# Altium schematic sheet 03 存储器扩展与BOOT.SchDoc
size A4
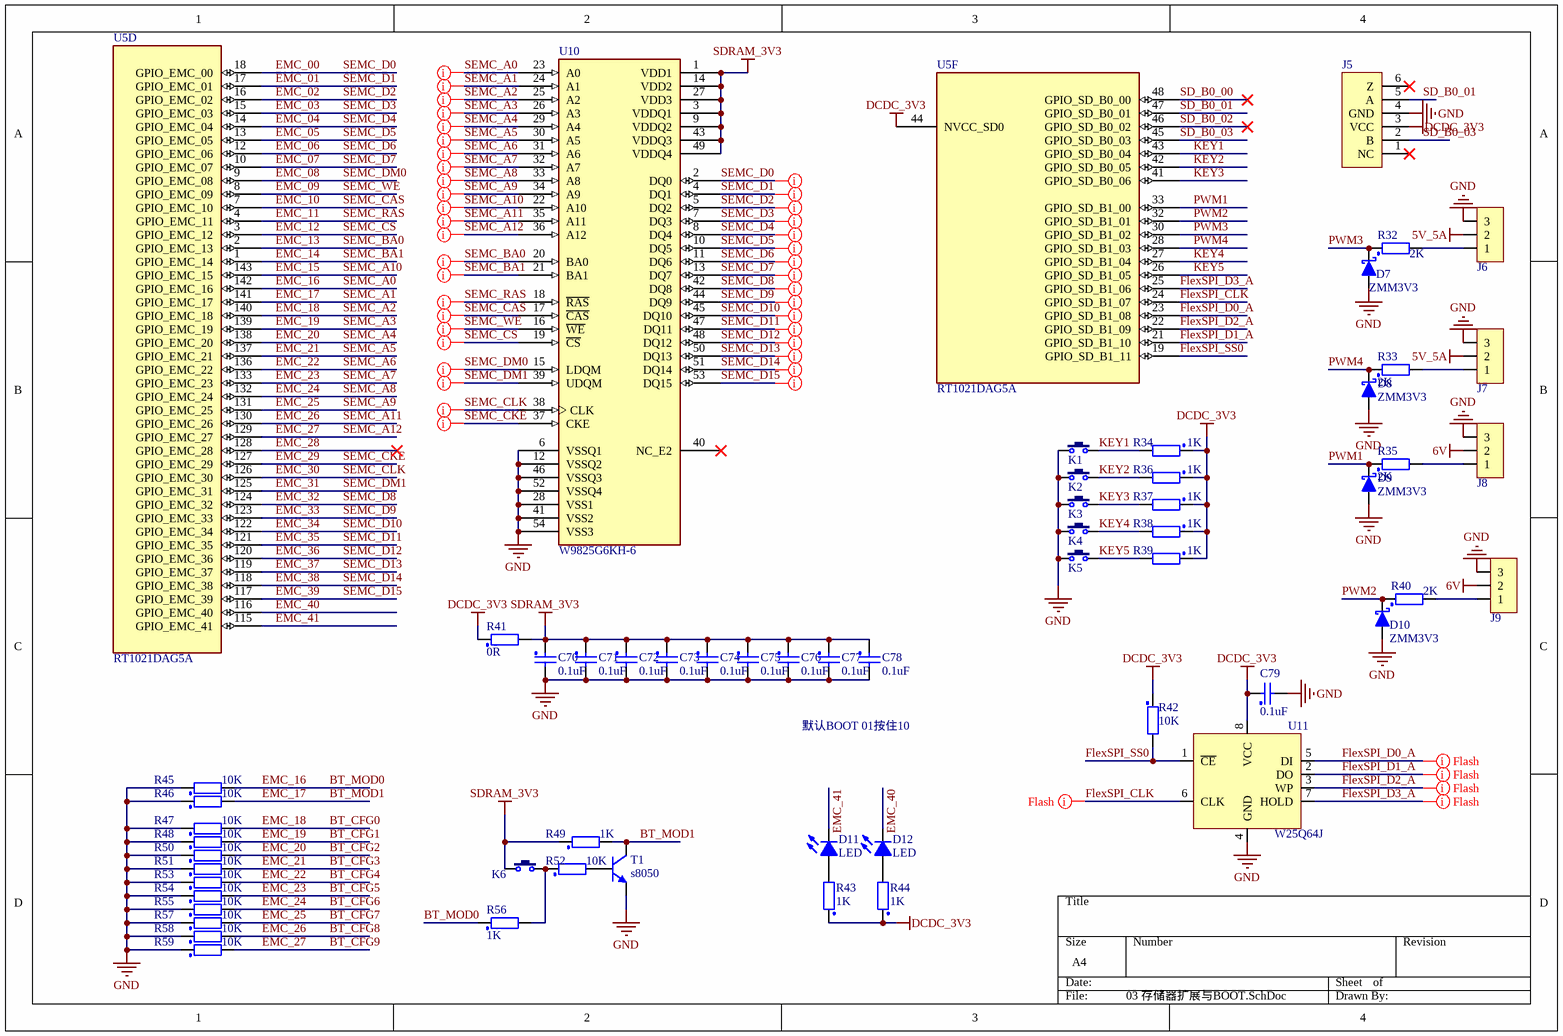
[diagram p0: 03 存储器扩展与BOOT.SchDoc]

## Parts
C70  0.1uF  [cap0603]
C71  0.1uF  [cap0603]
C72  0.1uF  [cap0603]
C73  0.1uF  [cap0603]
C74  0.1uF  [cap0603]
C75  0.1uF  [cap0603]
C76  0.1uF  [cap0603]
C77  0.1uF  [cap0603]
C78  0.1uF  [cap0603]
C79  0.1uF  [cap0603]
D7  ZMM3V3  [LL34]
D8  ZMM3V3  [LL34]
D9  ZMM3V3  [LL34]
D10  ZMM3V3  [LL34]
D11  LED  [LED]
D12  LED  [LED]
J5  2x6  [LQ256Encoder]  (value not drawn)
J6  1X3  [HDR-1X3]  (value not drawn)
J7  1X3  [HDR-1X3]  (value not drawn)
J8  1X3  [HDR-1X3]  (value not drawn)
J9  1X3  [HDR-1X3]  (value not drawn)
K1  KEY  [key]  (value not drawn)
K2  KEY  [key]  (value not drawn)
K3  KEY  [key]  (value not drawn)
K4  KEY  [key]  (value not drawn)
K5  KEY  [key]  (value not drawn)
K6  KEY  [key]  (value not drawn)
R32  2K  [res0603]
R33  2K  [res0603]
R34  1K  [res0603]
R35  2K  [res0603]
R36  1K  [res0603]
R37  1K  [res0603]
R38  1K  [res0603]
R39  1K  [res0603]
R40  2K  [res0603]
R41  0R  [res0603]
R42  10K  [res0603]
R43  1K  [res0603]
R44  1K  [res0603]
R45  10K  [res0603]
R46  10K  [res0603]
R47  10K  [res0603]
R48  10K  [res0603]
R49  1K  [res0603]
R50  10K  [res0603]
R51  10K  [res0603]
R52  10K  [res0603]
R53  10K  [res0603]
R54  10K  [res0603]
R55  10K  [res0603]
R56  1K  [res0603]
R57  10K  [res0603]
R58  10K  [res0603]
R59  10K  [res0603]
T1  s8050  [SOT-23-3]
U5  RT1021DAG5A  [LQFP144]  (parts D,F of 6)
U10  W9825G6KH-6  [TSOP(II)-54]
U11  W25Q64J  [SOIC8-208mil]

## Nets
5V_5A: J6.2 J7.2
6V: J8.2 J9.2
DCDC_3V3: C79.1 J5.3(VCC) R34.1 R36.1 R37.1 R38.1 R39.1 R41.1 R42.1 R43.1 R44.1 U5.44(NVCC_SD0) U11.8(VCC)
GND: C70.2 C71.2 C72.2 C73.2 C74.2 C75.2 C76.2 C77.2 C78.2 C79.2 D7.1(A) D8.1(A) D9.1(A) D10.1(A) J5.4(GND) J6.3 J7.3 J8.3 J9.3 K1.1 K2.1 K3.1 K4.1 K5.1 R45.1 R46.1 R47.1 R48.1 R50.1 R51.1 R53.1 R54.1 R55.1 R57.1 R58.1 R59.1 T1.2(E) U10.6(VSSQ1) U10.12(VSSQ2) U10.28(VSS1) U10.41(VSS2) U10.46(VSSQ3) U10.52(VSSQ4) U10.54(VSS3) U11.4(GND)
SDRAM_3V3: C70.1 C71.1 C72.1 C73.1 C74.1 C75.1 C76.1 C77.1 C78.1 K6.1 R41.2 R49.1 U10.1(VDD1) U10.3(VDDQ1) U10.9(VDDQ2) U10.14(VDD2) U10.27(VDD3) U10.43(VDDQ3) U10.49(VDDQ4)
BT_CFG0: R47.2 U5.140(GPIO_EMC_18) U10.25(A2)  [also labelled EMC_18, SEMC_A2]
BT_CFG1: R48.2 U5.139(GPIO_EMC_19) U10.26(A3)  [also labelled EMC_19, SEMC_A3]
BT_CFG2: R50.2 U5.138(GPIO_EMC_20) U10.29(A4)  [also labelled EMC_20, SEMC_A4]
BT_CFG3: R51.2 U5.137(GPIO_EMC_21) U10.30(A5)  [also labelled EMC_21, SEMC_A5]
BT_CFG4: R53.2 U5.136(GPIO_EMC_22) U10.31(A6)  [also labelled EMC_22, SEMC_A6]
BT_CFG5: R54.2 U5.133(GPIO_EMC_23) U10.32(A7)  [also labelled EMC_23, SEMC_A7]
BT_CFG6: R55.2 U5.132(GPIO_EMC_24) U10.33(A8)  [also labelled EMC_24, SEMC_A8]
BT_CFG7: R57.2 U5.131(GPIO_EMC_25) U10.34(A9)  [also labelled EMC_25, SEMC_A9]
BT_CFG8: R58.2 U5.130(GPIO_EMC_26) U10.35(A11)  [also labelled EMC_26, SEMC_A11]
BT_CFG9: R59.2 U5.129(GPIO_EMC_27) U10.36(A12)  [also labelled EMC_27, SEMC_A12]
BT_MOD0: R45.2 R56.1 U5.142(GPIO_EMC_16) U10.23(A0)  [also labelled EMC_16, SEMC_A0]
BT_MOD1: R46.2 R49.2 T1.3(C) U5.141(GPIO_EMC_17) U10.24(A1)  [also labelled EMC_17, SEMC_A1]
EMC_00: U5.18(GPIO_EMC_00) U10.2(DQ0)  [also labelled SEMC_D0]
EMC_01: U5.17(GPIO_EMC_01) U10.4(DQ1)  [also labelled SEMC_D1]
EMC_02: U5.16(GPIO_EMC_02) U10.5(DQ2)  [also labelled SEMC_D2]
EMC_03: U5.15(GPIO_EMC_03) U10.7(DQ3)  [also labelled SEMC_D3]
EMC_04: U5.14(GPIO_EMC_04) U10.8(DQ4)  [also labelled SEMC_D4]
EMC_05: U5.13(GPIO_EMC_05) U10.10(DQ5)  [also labelled SEMC_D5]
EMC_06: U5.12(GPIO_EMC_06) U10.11(DQ6)  [also labelled SEMC_D6]
EMC_07: U5.10(GPIO_EMC_07) U10.13(DQ7)  [also labelled SEMC_D7]
EMC_08: U5.9(GPIO_EMC_08) U10.15(LDQM)  [also labelled SEMC_DM0]
EMC_09: U5.8(GPIO_EMC_09) U10.16(~{WE})  [also labelled SEMC_WE]
EMC_10: U5.7(GPIO_EMC_10) U10.17(~{CAS})  [also labelled SEMC_CAS]
EMC_11: U5.4(GPIO_EMC_11) U10.18(~{RAS})  [also labelled SEMC_RAS]
EMC_12: U5.3(GPIO_EMC_12) U10.19(~{CS})  [also labelled SEMC_CS]
EMC_13: U5.2(GPIO_EMC_13) U10.20(BA0)  [also labelled SEMC_BA0]
EMC_14: U5.1(GPIO_EMC_14) U10.21(BA1)  [also labelled SEMC_BA1]
EMC_15: U5.143(GPIO_EMC_15) U10.22(A10)  [also labelled SEMC_A10]
EMC_28: U5.128(GPIO_EMC_28)
EMC_29: U5.127(GPIO_EMC_29) U10.37(CKE)  [also labelled SEMC_CKE]
EMC_30: U5.126(GPIO_EMC_30) U10.38(CLK)  [also labelled SEMC_CLK]
EMC_31: U5.125(GPIO_EMC_31) U10.39(UDQM)  [also labelled SEMC_DM1]
EMC_32: U5.124(GPIO_EMC_32) U10.42(DQ8)  [also labelled SEMC_D8]
EMC_33: U5.123(GPIO_EMC_33) U10.44(DQ9)  [also labelled SEMC_D9]
EMC_34: U5.122(GPIO_EMC_34) U10.45(DQ10)  [also labelled SEMC_D10]
EMC_35: U5.121(GPIO_EMC_35) U10.47(DQ11)  [also labelled SEMC_D11]
EMC_36: U5.120(GPIO_EMC_36) U10.48(DQ12)  [also labelled SEMC_D12]
EMC_37: U5.119(GPIO_EMC_37) U10.50(DQ13)  [also labelled SEMC_D13]
EMC_38: U5.118(GPIO_EMC_38) U10.51(DQ14)  [also labelled SEMC_D14]
EMC_39: U5.117(GPIO_EMC_39) U10.53(DQ15)  [also labelled SEMC_D15]
EMC_40: D12.2(K) U5.116(GPIO_EMC_40)
EMC_41: D11.2(K) U5.115(GPIO_EMC_41)
FlexSPI_CLK: U5.24(GPIO_SD_B1_07) U11.6(CLK)
FlexSPI_D0_A: U5.23(GPIO_SD_B1_08) U11.5(DI)
FlexSPI_D1_A: U5.21(GPIO_SD_B1_10) U11.2(DO)
FlexSPI_D2_A: U5.22(GPIO_SD_B1_09) U11.3(WP)
FlexSPI_D3_A: U5.25(GPIO_SD_B1_06) U11.7(HOLD)
FlexSPI_SS0: R42.2 U5.19(GPIO_SD_B1_11) U11.1(~{CE})
KEY1: K1.2 R34.2 U5.43(GPIO_SD_B0_04)
KEY2: K2.2 R36.2 U5.42(GPIO_SD_B0_05)
KEY3: K3.2 R37.2 U5.41(GPIO_SD_B0_06)
KEY4: K4.2 R38.2 U5.27(GPIO_SD_B1_04)
KEY5: K5.2 R39.2 U5.26(GPIO_SD_B1_05)
PWM1: D9.2(K) R35.1 U5.33(GPIO_SD_B1_00)
PWM2: D10.2(K) R40.1 U5.32(GPIO_SD_B1_01)
PWM3: D7.2(K) R32.1 U5.30(GPIO_SD_B1_02)
PWM4: D8.2(K) R33.1 U5.28(GPIO_SD_B1_03)
SD_B0_00: U5.48(GPIO_SD_B0_00)
SD_B0_01: J5.5(A) U5.47(GPIO_SD_B0_01)
SD_B0_02: U5.46(GPIO_SD_B0_02)
SD_B0_03: J5.2(B) U5.45(GPIO_SD_B0_03)
NetD11_1: D11.1(A) R43.2
NetD12_1: D12.1(A) R44.2
NetJ6_1: J6.1 R32.2
NetJ7_1: J7.1 R33.2
NetJ8_1: J8.1 R35.2
NetJ9_1: J9.1 R40.2
NetK6_2: K6.2 R52.1 R56.2
NetR52_2: R52.2 T1.1(B)

Not connected (* = marked no-connect by the designer): J5 1(NC)* 6(Z)*; U10 40(NC_E2)*

## Layout directives
net class FLASH: FlexSPI_CLK, FlexSPI_D0_A, FlexSPI_D1_A, FlexSPI_D2_A, FlexSPI_D3_A
net class SDRAM_A: BT_CFG0, BT_CFG1, BT_CFG2, BT_CFG3, BT_CFG4, BT_CFG5, BT_CFG6, BT_CFG7, BT_CFG8, BT_CFG9, BT_MOD0, BT_MOD1, EMC_08, EMC_09, EMC_10, EMC_11, EMC_12, EMC_13, EMC_14, EMC_15, EMC_29, EMC_30, EMC_31
net class SDRAM_D: EMC_00, EMC_01, EMC_02, EMC_03, EMC_04, EMC_05, EMC_06, EMC_07, EMC_32, EMC_33, EMC_34, EMC_35, EMC_36, EMC_37, EMC_38, EMC_39

## Notes on the sheet
- 默认BOOT 01按住10

## Library data of the parts
C70-C79 = Cap: 贴片电容; Published: 8-Jun-2000; LatestRevisionDate: 17-Jul-2002; LatestRevisionNote: Re-released for DXP Platform.; PackageReference: RAD-0.3; Publisher: Altium Limited; Value: 0.1uF
D7-D10 = D Schottky: 稳压二极管; Published: 8-Jun-2000; LatestRevisionDate: 17-Jul-2002; LatestRevisionNote: Re-released for DXP Platform.; PackageReference: SMB; Publisher: Altium Limited; Code_JEDEC: DO-214-AA
D11 D12 = LED: 贴片LED; Published: 8-Jun-2000; LatestRevisionDate: 17-Jul-2002; LatestRevisionNote: Re-released for DXP Platform.; PackageDocument: Feb-2002; PackageReference: 3.2X1.6X1.1; Publisher: Altium Limited
J5 = LQ_AB256: 2.54mm公排针
J6-J9 = Header 3: 2.54mm公排针; BOM名称: 3P接插件; 版权归属: 源创客; 学习资源: www.ooocke.com
K1-K6 = KEY: 按键; BOM名称: 3x6轻触开关; 版权归属: 源创客; 学习资源: www.ooocke.com
R32-R59 = Res: 贴片电阻; Published: 8-Jun-2000; LatestRevisionDate: 17-Jul-2002; LatestRevisionNote: Re-released for DXP Platform.; PackageReference: AXIAL-0.4; Publisher: Altium Limited
  R32 R33 R35 R40: Value: 2K
  R34 R36-R39 R43 R44 R49 R56: Value: 1K
  R41: Value: 0R
  R42 R45-R48 R50-R55 R57-R59: Value: 10K
T1 = s8050: 贴片三极管 NPN管
U5 = RT1021DAG5A: Cortex-M7 500MHZ 1.3V; ASSY_OPT: *; CLASS: *; SPLIT_INST: *; SWAP_INFO: *; AGILE_PN: *; MFG_NAME01: *; MFG_PN01: *; ROHS: *; Temp_Range: *; PRE_APN: *; CAD_APPROVED: *; HEIGHT: *; SILK: *
U10 = W9825G6KH-6: SDRAM 16MX16 6NS 3.3V TSOP(II)-54; CLASS: *; AGILE_PN: *; MFG_NAME01: *; MFG_PN01: *; ROHS: *; Temp_Range: *; PRE_APN: *; ASSY_OPT: *; CAD_APPROVED: *; HEIGHT: *; SILK: *
U11 = W25Q: flash